# EAGLE schematic ShieldTemplate (EAGLE 7.4.0)
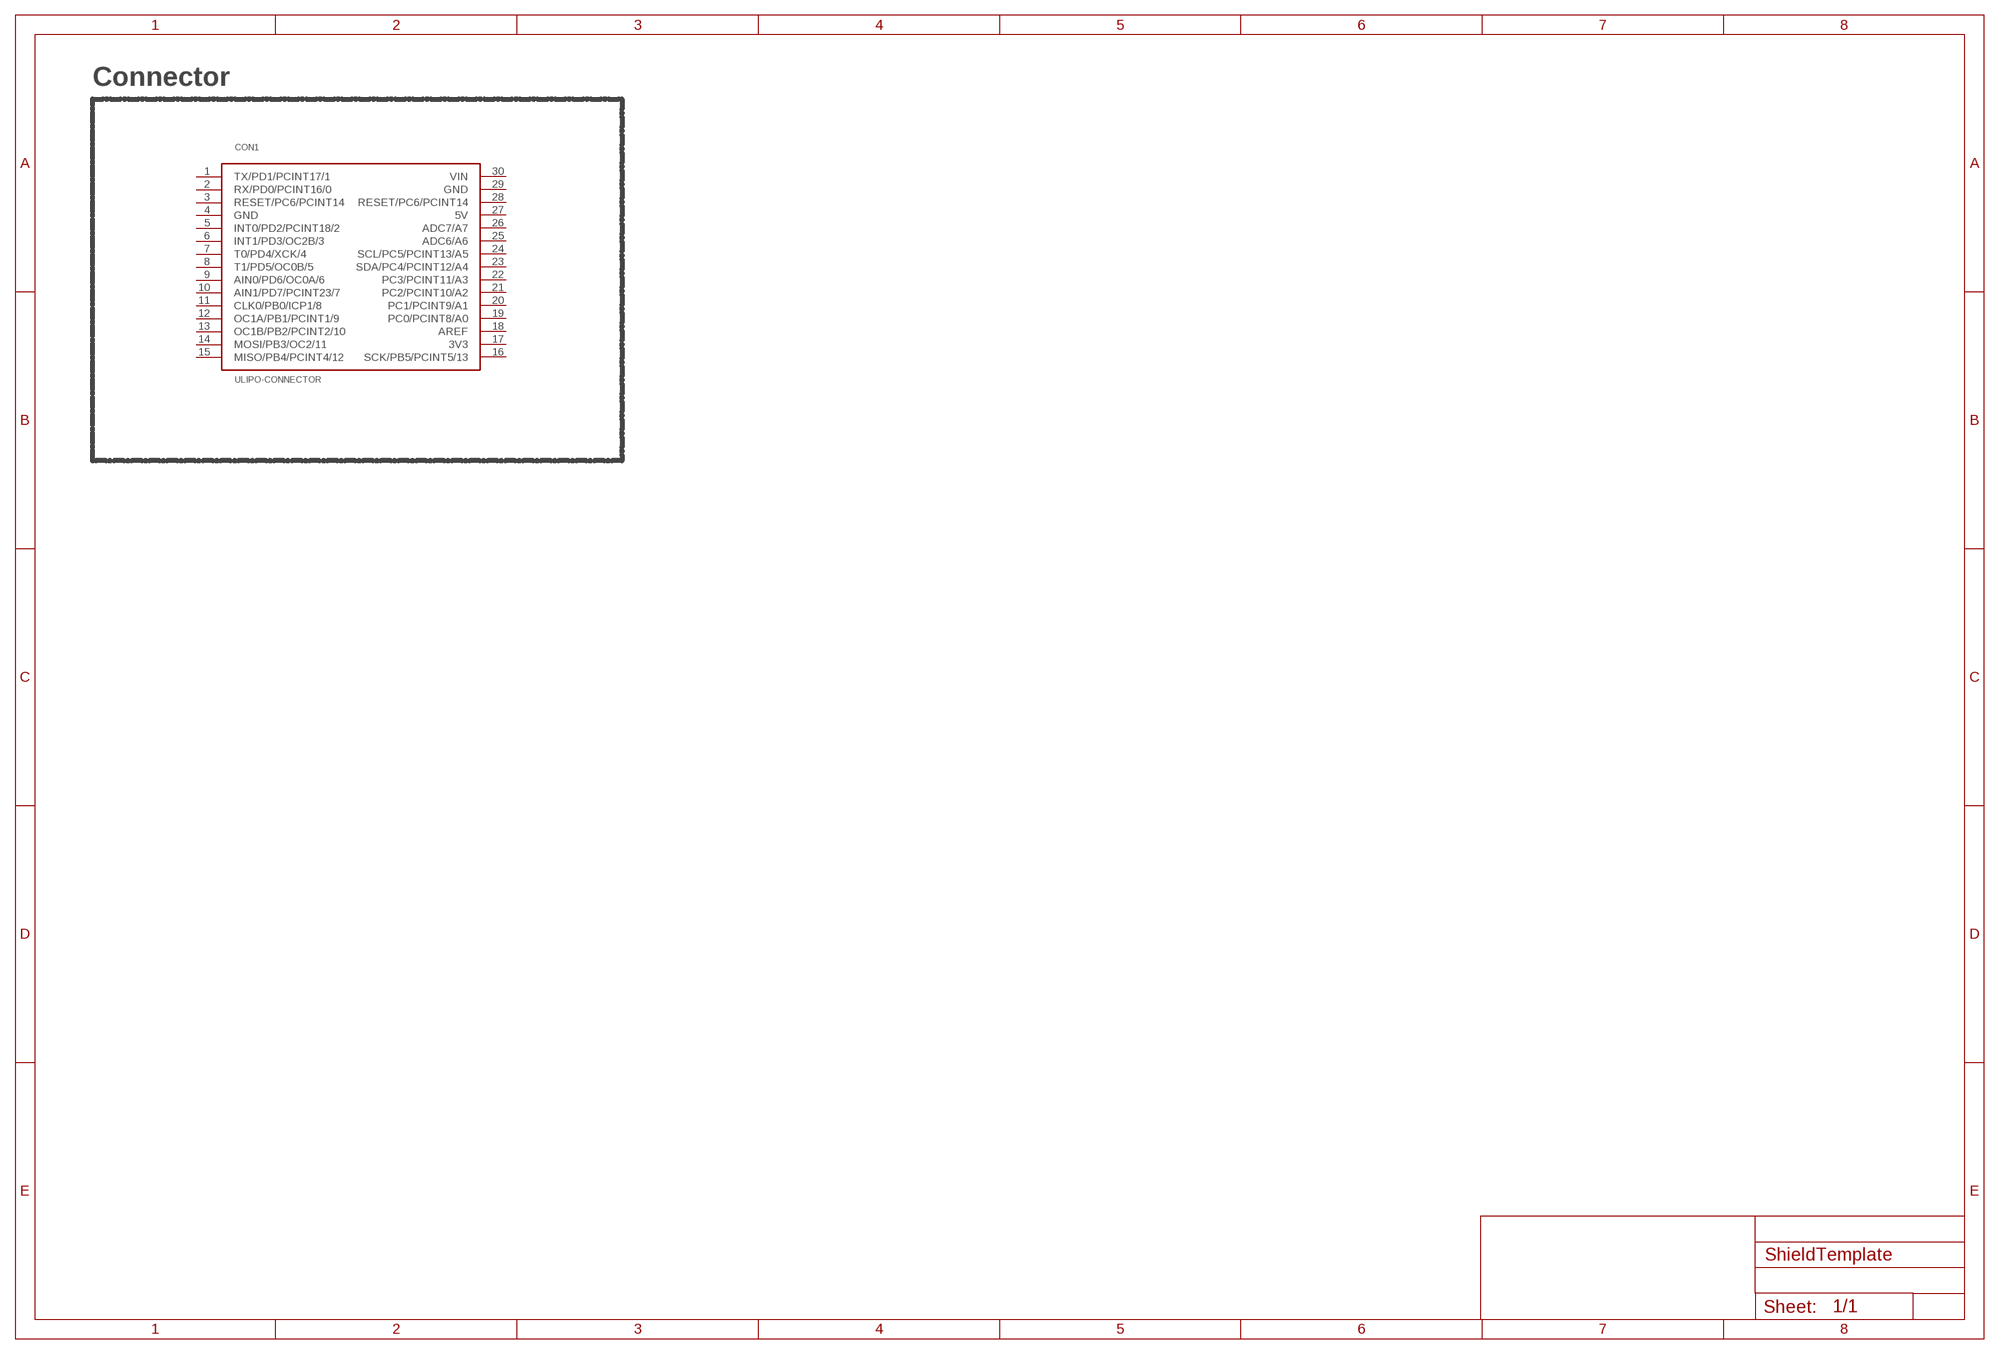
[diagram p0: schematic, sheet 1]

## Parts
CON1  ULIPO-CONNECTOR  [ULIPO-CONNECTOR]
Unconnected: CON1.1(TX/PD1/PCINT17/1) CON1.2(RX/PD0/PCINT16/0) CON1.3(RESET/PC6/PCINT14) CON1.4(GND) CON1.5(INT0/PD2/PCINT18/2) CON1.6(INT1/PD3/OC2B/3) CON1.7(T0/PD4/XCK/4) CON1.8(T1/PD5/OC0B/5) CON1.9(AIN0/PD6/OC0A/6) CON1.10(AIN1/PD7/PCINT23/7) CON1.11(CLK0/PB0/ICP1/8) CON1.12(OC1A/PB1/PCINT1/9) CON1.13(OC1B/PB2/PCINT2/10) CON1.14(MOSI/PB3/OC2/11) CON1.15(MISO/PB4/PCINT4/12) CON1.16(SCK/PB5/PCINT5/13) CON1.17(3V3) CON1.18(AREF) CON1.19(PC0/PCINT8/A0) CON1.20(PC1/PCINT9/A1) CON1.21(PC2/PCINT10/A2) CON1.22(PC3/PCINT11/A3) CON1.23(SDA/PC4/PCINT12/A4) CON1.24(SCL/PC5/PCINT13/A5) CON1.25(ADC6/A6) CON1.26(ADC7/A7) CON1.27(5V) CON1.28(RESET/PC6/PCINT14) CON1.29(GND) CON1.30(VIN)

## Notes on the sheet
- Connector

## Library data of the parts
CON1 = TM-misc:ULIPO-CONNECTOR: Connector for the uLipo Dev Board